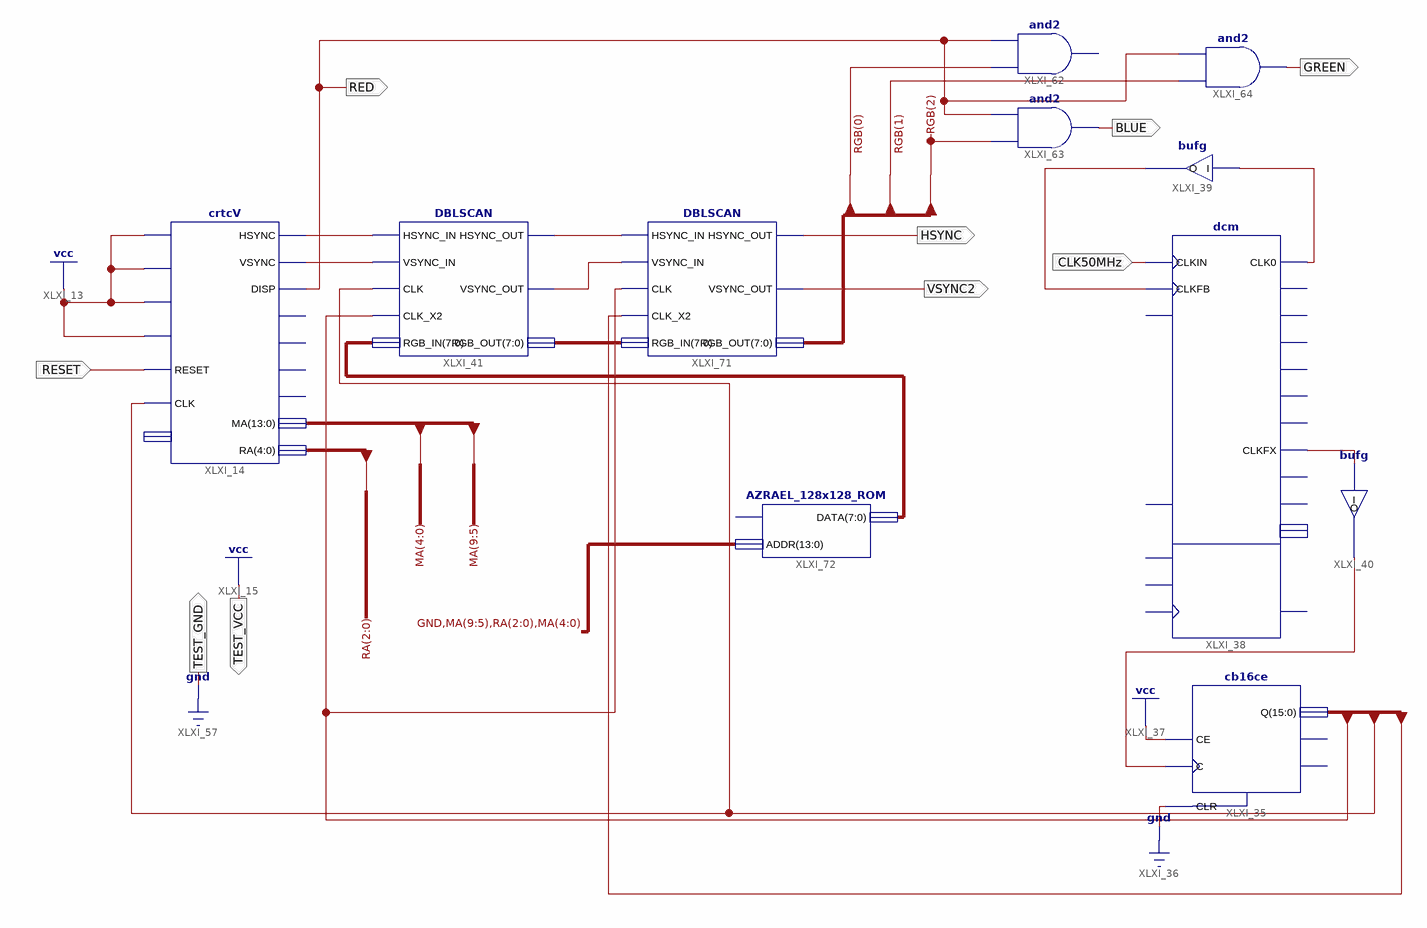
[diagram p0: schematic sheet 1]
// Xilinx ISE schematic full_graphic_display_light.sch (spartan3) as structural Verilog: 11 symbols, 9 ports
module full_graphic_display_light (
  input  CLK50MHz,
  input  RESET,
  output RED,
  output BLUE,
  output GREEN,
  output TEST_VCC,
  output TEST_GND,
  output VSYNC2,
  output HSYNC
);

  wire CLK1MHz, GND, XLXN_72, XLXN_73, XLXN_74, XLXN_136, XLXN_153, XLXN_170, XLXN_171;
  wire [4:0] RA;
  wire [7:0] RGB, XLXN_109, XLXN_177;
  wire [13:0] MA;
  wire [15:0] CLKOUT;

  cb16ce XLXI_35 (.C(CLK1MHz), .CE(1'b1), .CLR(1'b0), .Q(CLKOUT));  // open: CEO, TC
  bufg XLXI_40 (.I(XLXN_72), .O(CLK1MHz));
  bufg XLXI_39 (.I(XLXN_73), .O(XLXN_74));
  dcm #(.CLKFX_MULTIPLY(4), .CLKFX_DIVIDE(3)) XLXI_38 (
    .CLKFB(XLXN_74), .CLKIN(CLK50MHz), .CLK0(XLXN_73), .CLKFX(XLXN_72));  // open: DSSEN, PSCLK, PSEN, PSINCDEC, RST, CLK180, CLK270, CLK2X, CLK2X180, CLK90, CLKDV, CLKFX180, LOCKED, PSDONE, STATUS
  // and2 XLXI_62 has open pins: I0=RGB[0], I1=RED, O=open
  and XLXI_63 (BLUE, RGB[2], RED);
  and XLXI_64 (GREEN, RGB[1], RED);
  crtcV XLXI_14 (
    .IOCLK(1'b1), .RS(1'b1), .CS(1'b1), .RW(1'b1), .RESET(RESET), .CLK(CLKOUT[5]), .HSYNC(XLXN_153),
    .VSYNC(XLXN_136), .DISP(RED), .MA(MA), .RA(RA));  // open: Din, CPCHSYNC, CPCVSYNC, CPCDISP, CPCBLACK
  DBLSCAN XLXI_41 (
    .HSYNC_IN(XLXN_153), .VSYNC_IN(XLXN_136), .CLK(CLKOUT[5]), .CLK_X2(CLKOUT[4]), .RGB_IN(XLXN_109),
    .HSYNC_OUT(XLXN_170), .VSYNC_OUT(XLXN_171), .RGB_OUT(XLXN_177));
  DBLSCAN XLXI_71 (
    .HSYNC_IN(XLXN_170), .VSYNC_IN(XLXN_171), .CLK(CLKOUT[4]), .CLK_X2(CLKOUT[3]), .RGB_IN(XLXN_177),
    .HSYNC_OUT(HSYNC), .VSYNC_OUT(VSYNC2), .RGB_OUT(RGB));
  AZRAEL_128x128_ROM XLXI_72 (.ADDR({GND, MA[9:5], RA[2:0], MA[4:0]}), .DATA(XLXN_109));  // open: CLK

  assign TEST_GND = 1'b0;
  assign TEST_VCC = 1'b1;
endmodule
